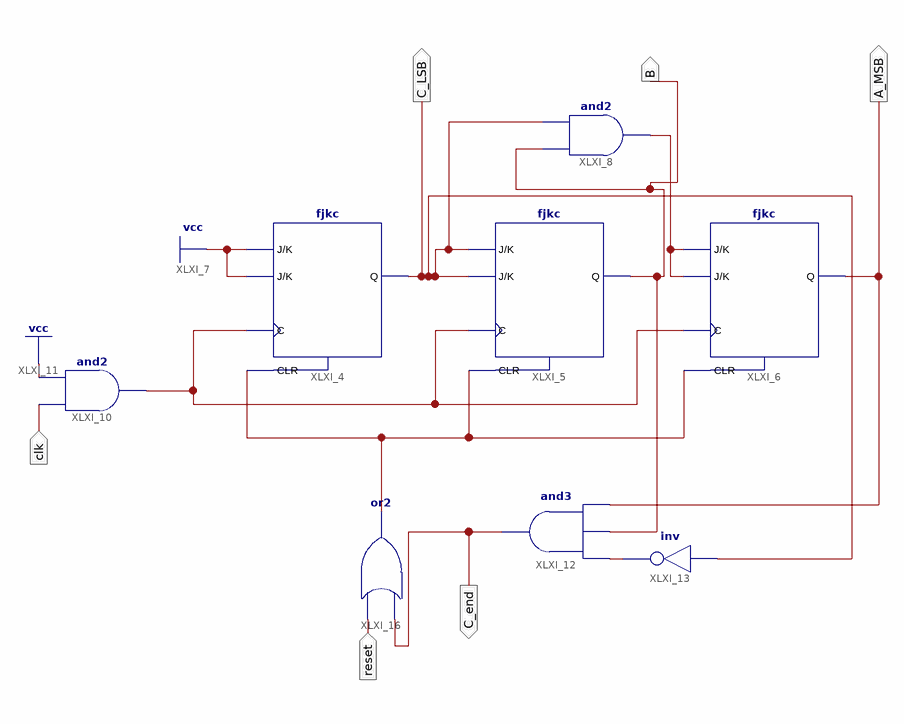
[diagram p0: schematic sheet 1]
// Xilinx ISE schematic Mod6.sch (spartan6) as structural Verilog: 8 symbols, 6 ports
module Mod6 (
  input  clk,
  input  reset,
  output C_LSB,
  output A_MSB,
  output B,
  output C_end
);

  wire XLXN_9, XLXN_15, XLXN_17, XLXN_18;

  fjkc XLXI_4 (.C(XLXN_15), .CLR(XLXN_18), .J(1'b1), .K(1'b1), .Q(C_LSB));
  fjkc XLXI_5 (.C(XLXN_15), .CLR(XLXN_18), .J(C_LSB), .K(C_LSB), .Q(B));
  fjkc XLXI_6 (.C(XLXN_15), .CLR(XLXN_18), .J(XLXN_9), .K(XLXN_9), .Q(A_MSB));
  and XLXI_8 (XLXN_9, B, C_LSB);
  and XLXI_10 (XLXN_15, clk, 1'b1);
  and XLXI_12 (C_end, A_MSB, B, XLXN_17);
  not XLXI_13 (XLXN_17, C_LSB);
  or XLXI_16 (XLXN_18, C_end, reset);
endmodule
